# EAGLE design CBM_TAPE_PI (EAGLE 9.6.2)
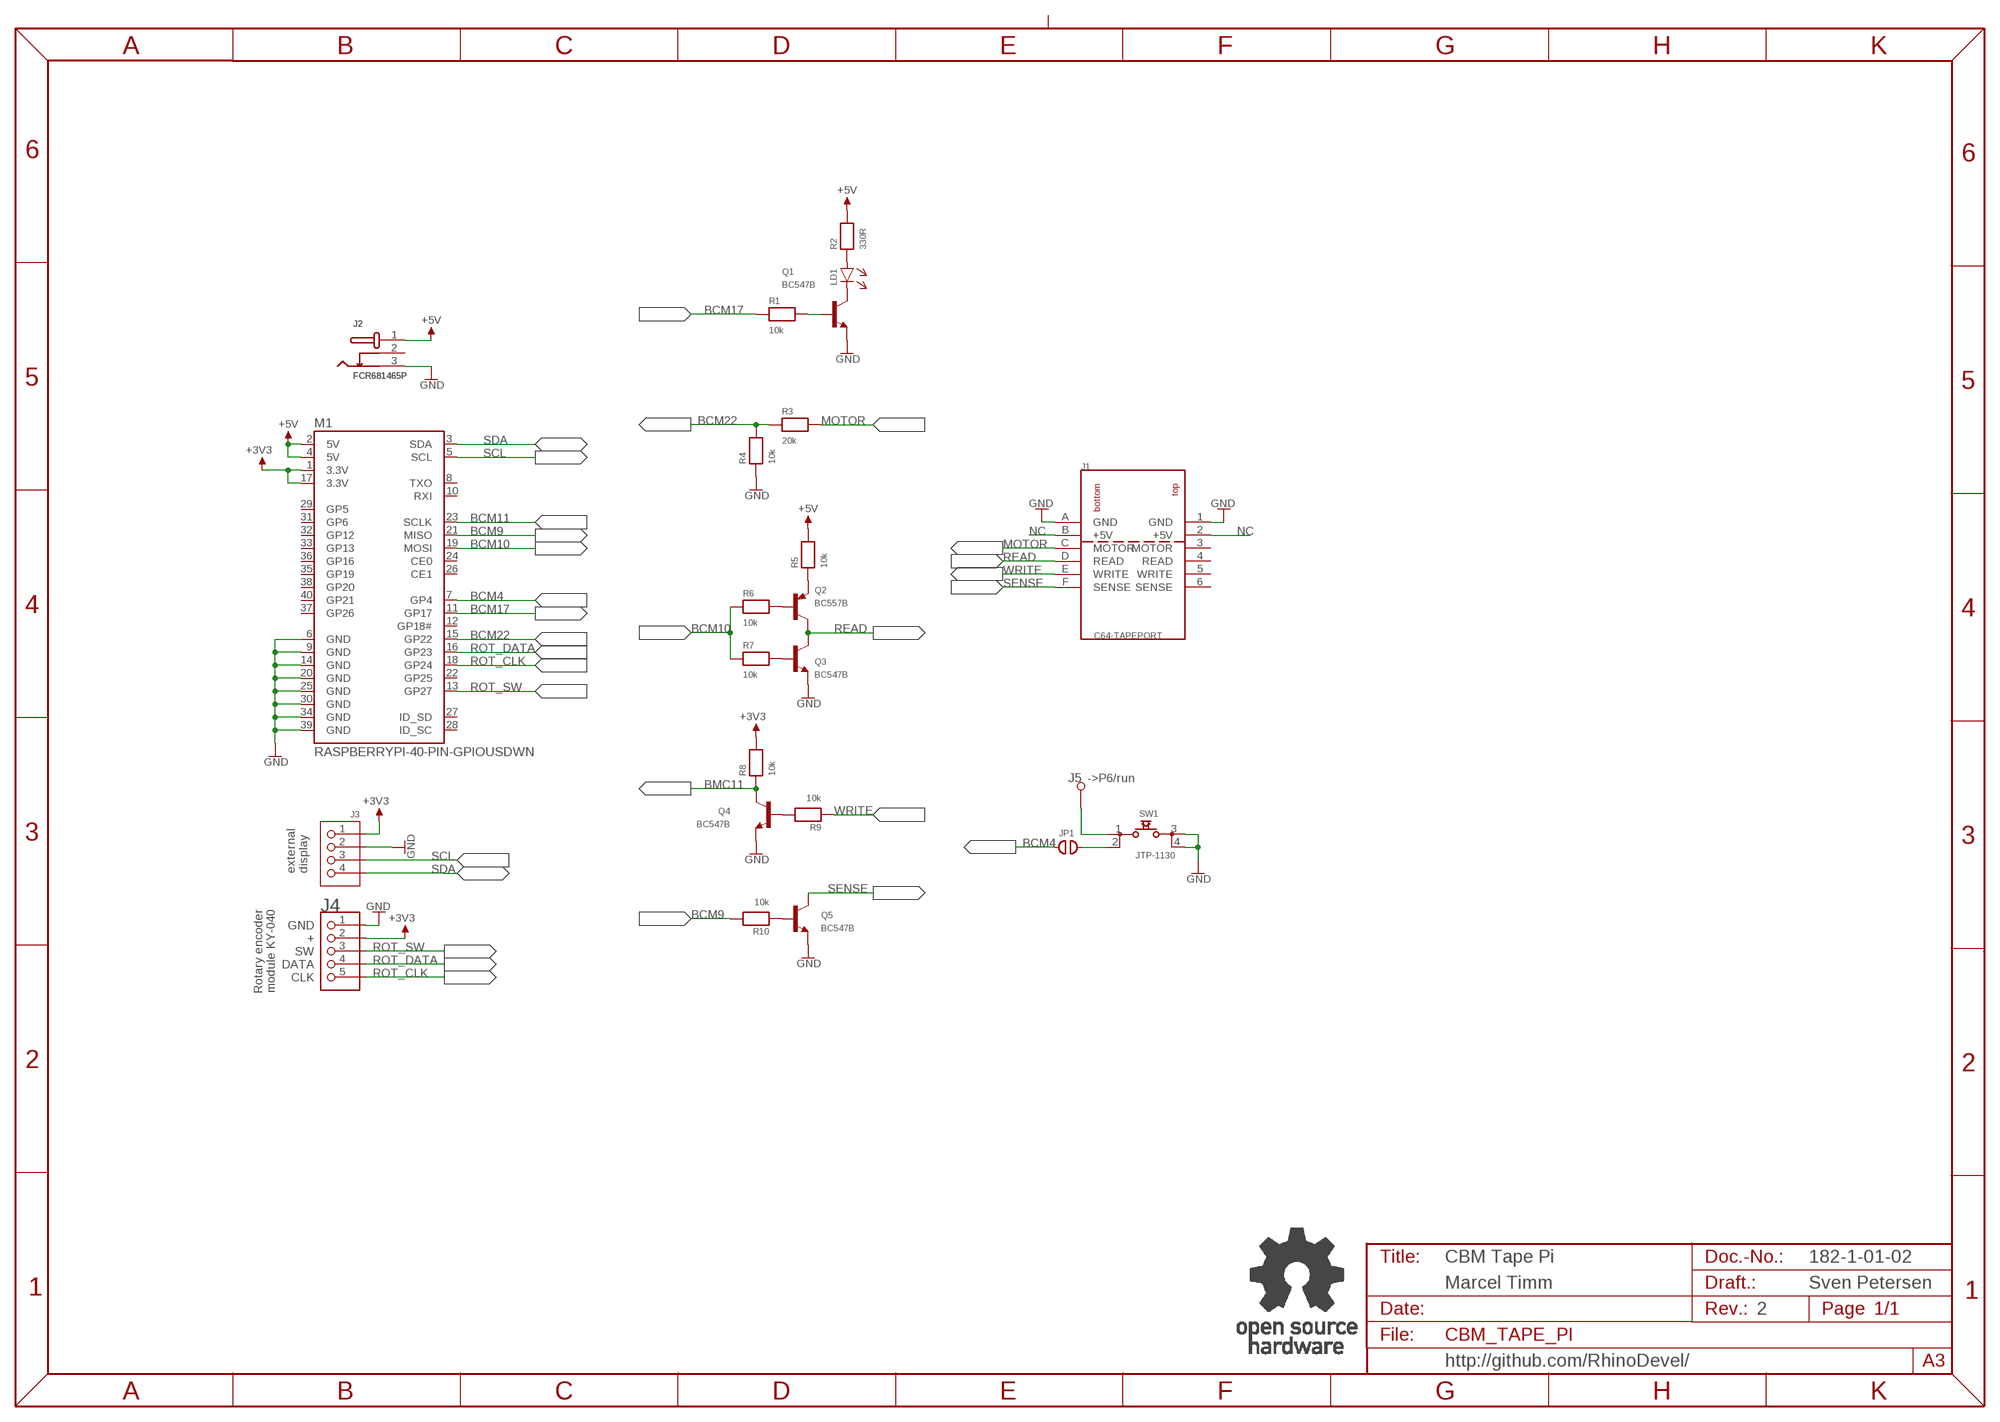
[diagram p0: schematic, sheet 1]

## Parts
J1  C64-TAPEPORT  [TAPEPORT]
J2  FCR681465P  [FCR681465P]
J3  6410-4P  [6410-4P]
J4  6410-5P  [6410-5P]
J5  L1,2_R  [1,2MM_R]
JP1  OPEN  [CP_OP]
LD1  3MM  [3MM]
M1  RASPBERRYPI-40-PIN-GPIOUSDWN  [PI_HAT_40P_UPSIDEDOWN]
Q1  BC547B  [TO92]
Q2  BC557B  [TO92-EBC]
Q3  BC547B  [TO92]
Q4  BC547B  [TO92]
Q5  BC547B  [TO92]
R1  10k  RES04  [R-10]
R2  330R  RES04  [R-10]
R3  20k  RES04  [R-10]
R4  10k  RES04  [R-10]
R5  10k  RES04  [R-10]
R6  10k  RES04  [R-10]
R7  10k  RES04  [R-10]
R8  10k  RES04  [R-10]
R9  10k  RES04  [R-10]
R10  10k  RES04  [R-10]
SW1  JTP-1130  [JTP-1130]
U$2  OPEN_SOURCE_HW  [OPENHW]

## Nets
+3V3: J3.1 J4.2 M1.1(3.3V) M1.17(3.3V) R8.2
+5V: J2.1 M1.2(5V) M1.4(5V) R2.2 R5.2
BCM4: JP1.1 M1.7(GP4)
BCM9: M1.21(MISO) R10.2
BCM10: M1.19(MOSI) R6.1 R7.1
BCM11: M1.23(SCLK)
BCM17: M1.11(GP17) R1.1
BCM22: M1.15(GP22) R3.1 R4.2
BMC11: Q4.3(C) R8.1
GND: J1.1(GND) J1.A(GND) J2.3 J3.2 J4.1 M1.6(GND) M1.9(GND) M1.14(GND) M1.20(GND) M1.25(GND) M1.30(GND) M1.34(GND) M1.39(GND) Q1.1(E) Q3.1(E) Q4.1(E) Q5.1(E) R4.1 SW1.3 SW1.4
MOTOR: J1.C(MOTOR) R3.2
N$1: Q1.2(B) R1.2
N$2: LD1.C(K) Q1.3(C)
N$3: LD1.A R2.1
N$4: Q2.E R5.1
N$5: Q2.B R6.2
N$6: Q3.2(B) R7.2
N$7: Q4.2(B) R9.2
N$8: Q5.2(B) R10.1
N$9: J5.1 SW1.1
N$10: JP1.2 SW1.2
NC: J1.2(+5V) J1.B(+5V)
READ: J1.D(READ) Q2.C Q3.3(C)
ROT_CLK: J4.5 M1.18(GP24)
ROT_DATA: J4.4 M1.16(GP23)
ROT_SW: J4.3 M1.13(GP27)
SCL: J3.3 M1.5(SCL)
SDA: J3.4 M1.3(SDA)
SENSE: J1.F(SENSE) Q5.3(C)
WRITE: J1.E(WRITE) R9.1
Unconnected: J1.3(MOTOR) J1.4(READ) J1.5(WRITE) J1.6(SENSE) J2.2 M1.8(TXO) M1.10(RXI) M1.12(GP18#) M1.22(GP25) M1.24(CE0) M1.26(CE1) M1.27(ID_SD) M1.28(ID_SC) M1.29(GP5) M1.31(GP6) M1.32(GP12) M1.33(GP13) M1.35(GP19) M1.36(GP16) M1.37(GP26) M1.38(GP20) M1.40(GP21)

## Notes on the sheet
- ->P6/run
- external
  display
- GND
- +
- Rotary encoder
  module KY-040
- SW
- DATA
- CLK
- CBM Tape Pi | 182-1-01-02
- Marcel Timm | Sven Petersen
- 2
- http://github.com/RhinoDevel/

## Library data of the parts
J1 = Commodore:C64-TAPEPORT
J2 = Cliff:FCR681465P
J3 = MOLEX:6410-4P: 6410/22-27-2041
J4 = MOLEX:6410-5P: 6410/22-27-2051
J5 = Pads:L1,2_R
JP1 = Cutpad:OPEN: open Cutpad
LD1 = LED:3MM
M1 = Raspberry_Pi:RASPBERRYPI-40-PIN-GPIO: 40 pin GPIO header with the footprint of a HAT
Q1 Q3-Q5 = Transistoren:BC547*: NPN Transistor
Q2 = Transistoren:BC557*: PNP Transistror
R1-R10 = DISCRETE:RES04
SW1 = Namae_Electronics:JTP-1130
U$2 = Logo:OPEN_SOURCE_HW

## Board
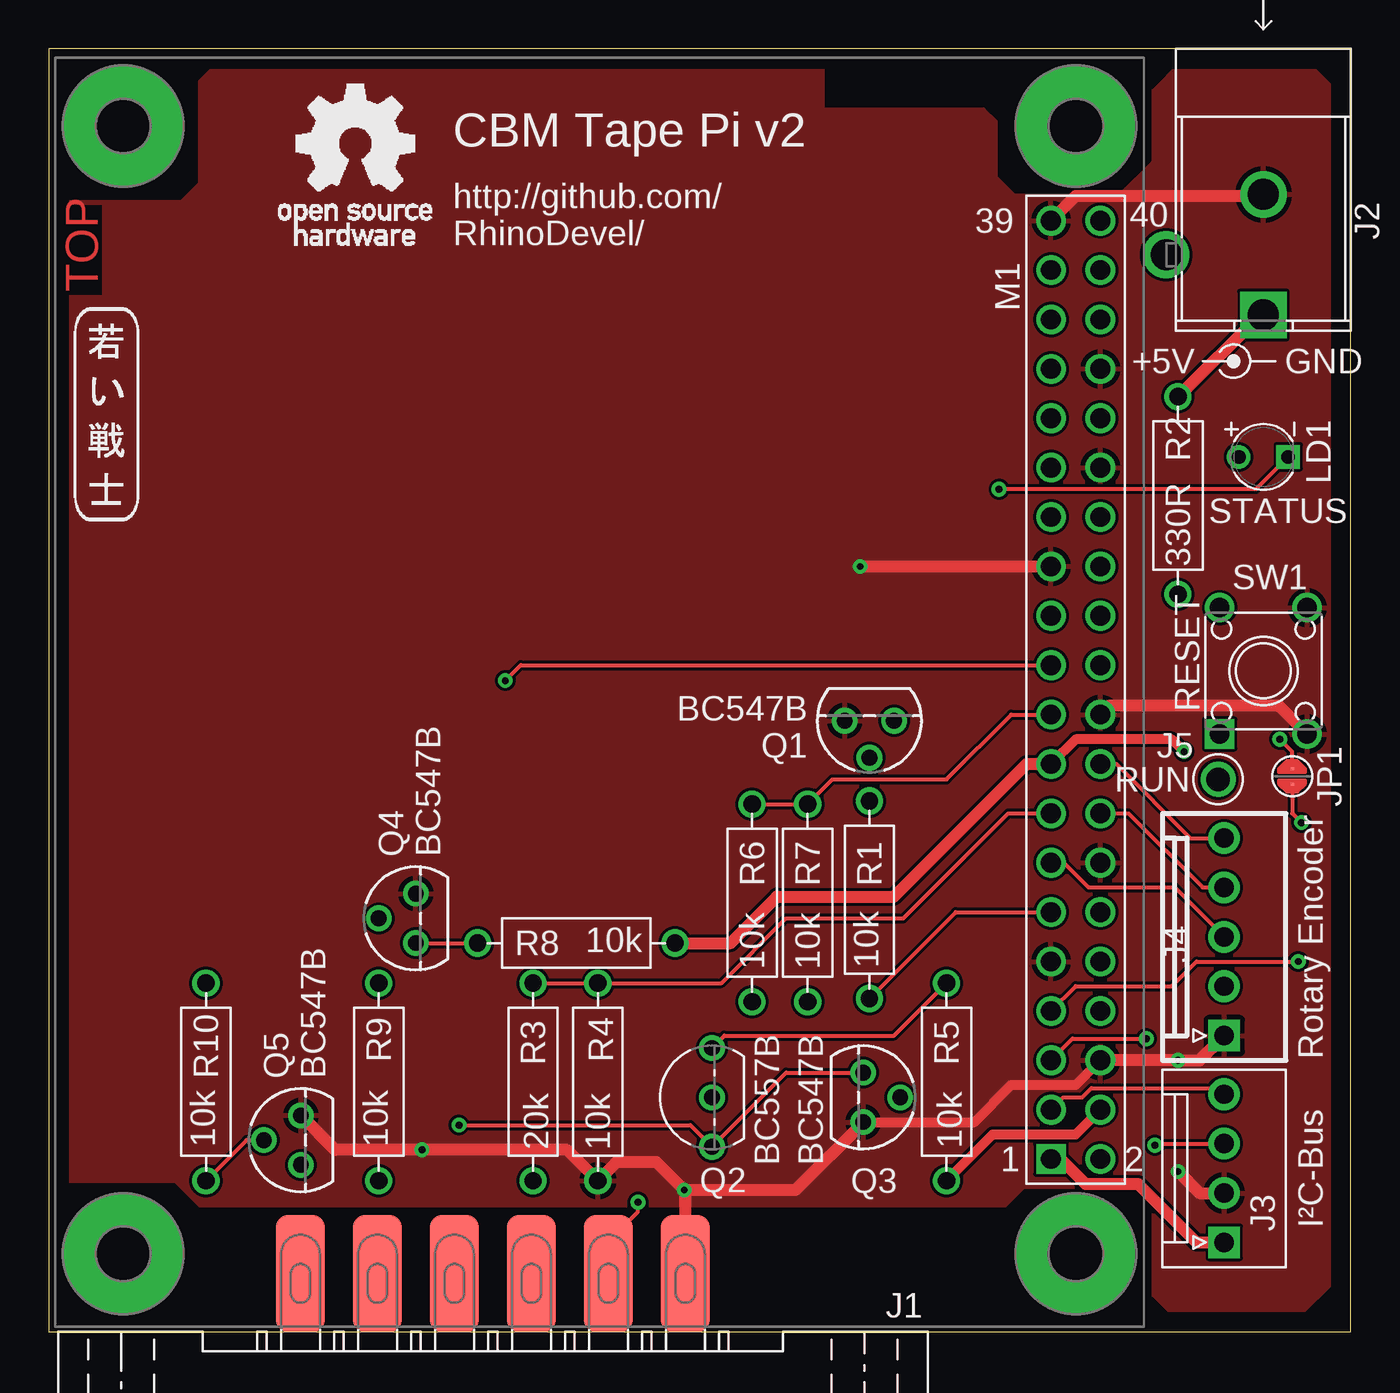
[diagram p1: board, top side]
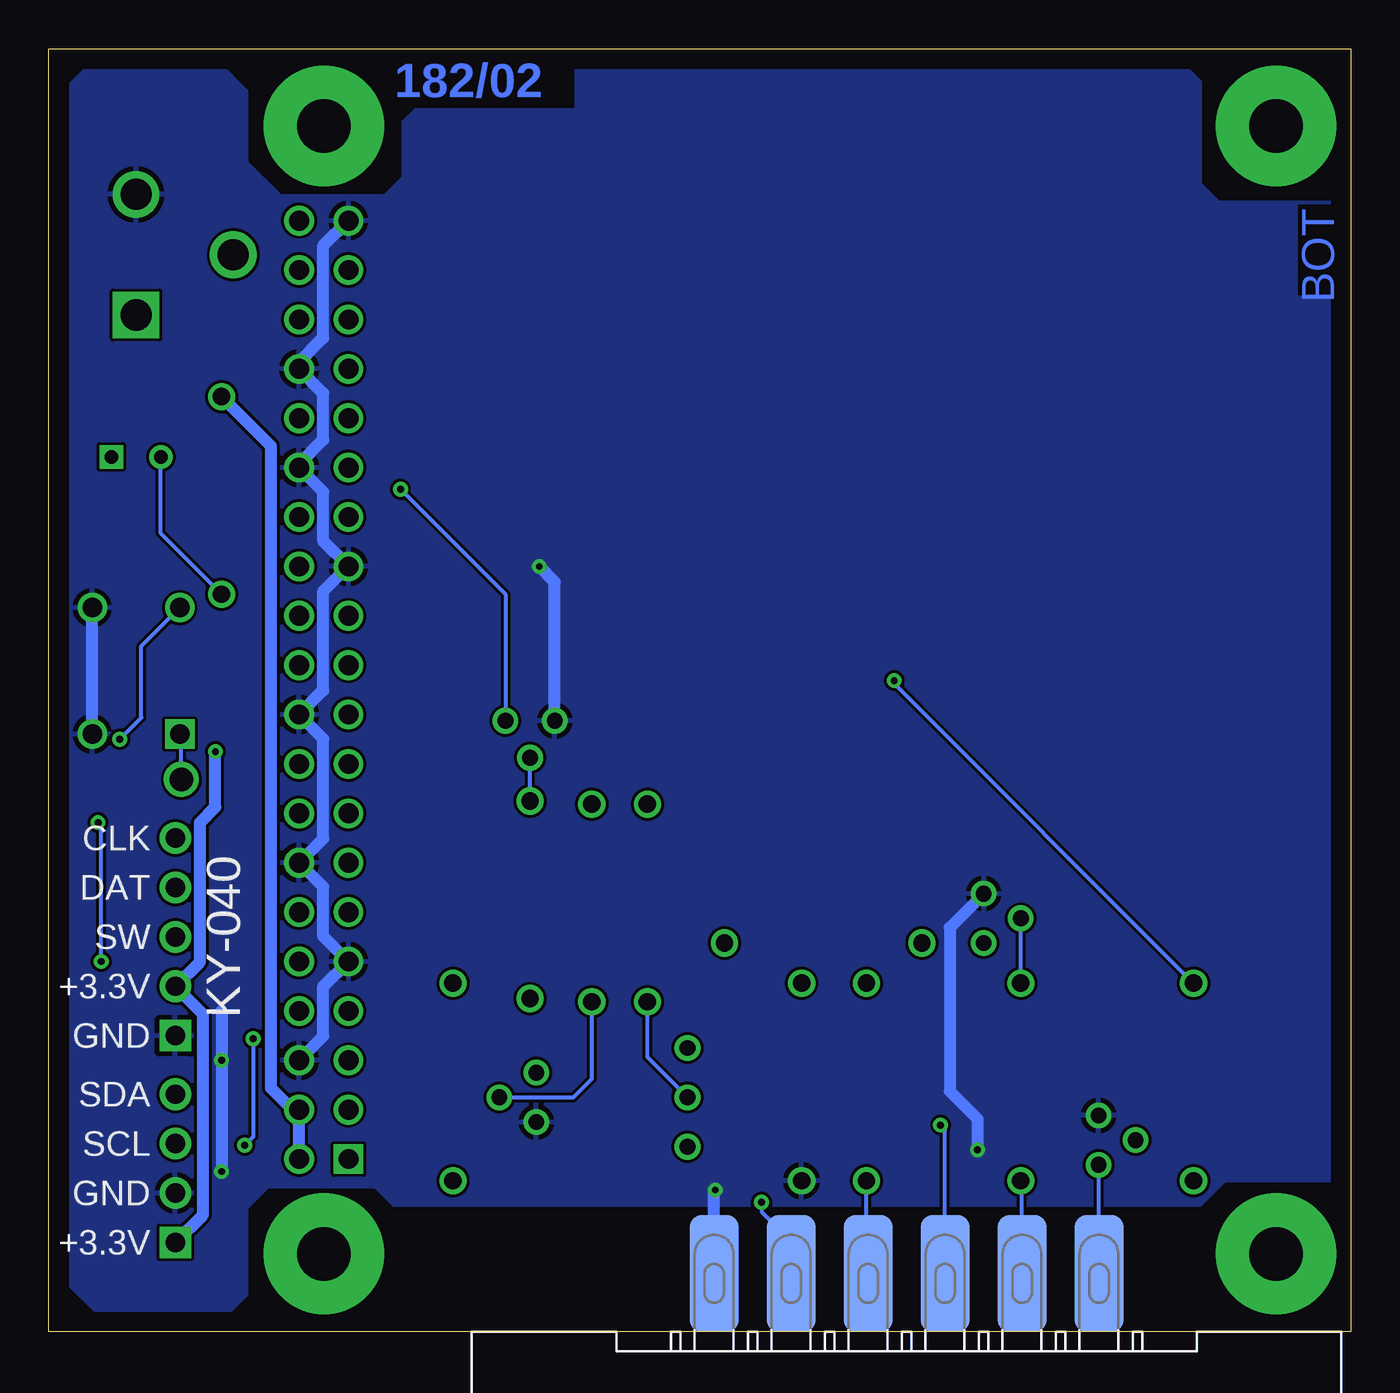
[diagram p2: board, bottom side, seen from below]

Size 67 x 66 mm. Coordinates in mm from the lower left corner, seen from the top.
Outline: 0,0 67,0 67,66 0,66 0,0
Copper layers (1*16): Top 0.035mm / dielectric 1.5mm / Bottom 0.035mm
Design rules "default *": minimum track width 6mil, minimum drill 0.35mm, track to track 6mil, track to pad 6mil, pad to pad 6mil, via to via 6mil, smd to smd 6mil, copper to edge 40mil, drill to drill 6mil, minimum pad ring 10mil, minimum via ring 8mil, stop-mask expansion 4mil, vias tented up to drill 25mil, thermal gap 10mil

### Footprints (pad centres in the part's own frame; a part is rotated, then mirrored left to right if it is on the bottom)
TAPEPORT = smd 2.5 x 6: 1 -9.9,-3; 2 -5.94,-3; 3 -1.98,-3; 4 1.98,-3; 5 5.94,-3; 6 9.9,-3 | smd 2.5 x 6 bottom: A -9.9,-3; B -5.94,-3; C -1.98,-3; D 1.98,-3; E 5.94,-3; F 9.9,-3
FCR681465P = drill 1.6 square: 1 0,13.7 | drill 1.6: 2 5,10.6; 3 0,7.5
6410-4P = drill 1 pad 1.626 square: 1 -3.81,0 | drill 1 pad 1.626: 2 -1.27,0; 3 1.27,0; 4 3.81,0
6410-5P = drill 1 pad 1.626 square: 1 -5.08,0 | drill 1 pad 1.626: 2 -2.54,0; 3 0,0; 4 2.54,0; 5 5.08,0
1,2MM_R = drill 1.2: 1 0,0
CP_OP = smd 0.152 x 0.152: 1 -0.4,0; 2 0.4,0
3MM = drill 0.7: A -1.27,0 | drill 0.7 square: C 1.27,0
PI_HAT_40P_UPSIDEDOWN = drill 1.016 square: 1 1.27,24.13 | drill 1.016: 2 -1.27,24.13; 3 1.27,21.59; 4 -1.27,21.59; 5 1.27,19.05; 6 -1.27,19.05; 7 1.27,16.51; 8 -1.27,16.51; 9 1.27,13.97; 10 -1.27,13.97; 11 1.27,11.43; 12 -1.27,11.43; 13 1.27,8.89; 14 -1.27,8.89; 15 1.27,6.35; 16 -1.27,6.35; 17 1.27,3.81; 18 -1.27,3.81; 19 1.27,1.27; 20 -1.27,1.27; 21 1.27,-1.27; 22 -1.27,-1.27; 23 1.27,-3.81; 24 -1.27,-3.81; 25 1.27,-6.35; 26 -1.27,-6.35; 27 1.27,-8.89; 28 -1.27,-8.89; 29 1.27,-11.43; 30 -1.27,-11.43; 31 1.27,-13.97; 32 -1.27,-13.97; 33 1.27,-16.51; 34 -1.27,-16.51; 35 1.27,-19.05; 36 -1.27,-19.05; 37 1.27,-21.59; 38 -1.27,-21.59; 39 1.27,-24.13; 40 -1.27,-24.13 | drill 2.75 pad 6.2: BHR1 0,-29; BHR2 0,29; BHR3 49,29; BHR4 49,-29
TO92 = drill 0.813: 1 1.27,0; 2 0,1.905; 3 -1.27,0
TO92-EBC = drill 0.813: B 0,-1.27; C -2.54,-1.27; E 2.54,-1.27
R-10 = drill 0.889 pad 1.397: 1 -5.08,0; 2 5.08,0
JTP-1130 = drill 1 square: 1 3.25,-2.25 | drill 1: 2 -3.25,-2.25; 3 3.25,2.25; 4 -3.25,2.25

### Placement (x,y rotation side)
J1  22.86,0 180 top
J2  62.5,66 180 top
J3  60.48,8.41 90 top
J4  60.48,20.32 90 top
J5  60.17,28.42 0 top
JP1  63.98,28.57 90 top
LD1  62.5,45 0 top
M1  52.84,33.02 180 top
Q1  42.23,31.43 180 top
Q2  32.86,12.06 90 top
Q3  41.91,12.06 270 top
Q4  18.89,21.27 90 top
Q5  12.98,9.86 90 top
R1  42.23,22.23 90 top
R2  58.1,43.02 90 top
R3  24.92,12.86 270 top
R4  28.26,12.86 90 top
R5  46.2,12.86 270 top
R6  36.2,22.07 270 top
R7  39.05,22.07 270 top
R8  27.15,20 0 top
R9  16.99,12.86 90 top
R10  8.1,12.86 90 top
SW1  62.5,34 270 top
U$2  11.84,55.9 0 top
U$53  [2LAYER]  2.54,53.5 90 top
U$54  [SVEN_TAG]  3.02,47.31 0 top
U$55  [PCB-TITLE/]  0,76.2 0 top  (outside the outline)

### Tracks (layer width: path | path; a pad name or v marks a point on that pad's centre or on a via)
+3V3  (via drill 0.35)
  Top 0.508: v58.42,29.84 57.78,30.48 52.84,30.48 M1.17
  Top 0.61: R8.2 35.08,20 37.47,22.38 43.5,22.38 50.32,29.21 M1.17 | M1.1 52.07,8.89 53.34,7.62 56.04,7.62 59.05,4.6 J3.1
  Bottom 0.61: J3.1 59.05,6.03 59.05,16.35 J4.2 59.21,19.05 59.21,26.19 58.42,26.99 v58.42,29.84
+5V
  Top 0.508: R5.2 48.58,10.16 52.84,10.16 M1.4
  Top 0.61: R2.2 62.3,52.3 J2.1
  Bottom 0.61: M1.2 M1.4 54.45,11.43 55.56,12.54 55.56,45.56 R2.2
BCM4  (via drill 0.35)
  Top 0.203: M1.7 52.84,17.78 57.78,17.78 59.05,19.05 v64.29,19.05 | JP1.1 63.98,26.67 v64.45,26.19
  Bottom 0.203: v64.29,19.05 64.29,26.04 v64.45,26.19
BCM9  (via drill 0.35)
  Top 0.203: v23.5,33.5 24.29,34.29 M1.21
  Bottom 0.203: R10.2 23.5,33.34 v23.5,33.5
BCM10
  Top 0.203: R6.1 R7.1 40.32,28.42 46.2,28.42 49.53,31.75 M1.19
BCM17
  Top 0.203: R1.1 46.67,21.59 M1.11
BCM22
  Top 0.203: R3.1 R4.2 34.61,17.94 37.94,21.27 43.97,21.27 49.37,26.67 M1.15
BMC11
  Top 0.203: Q4.3 R8.1
GND  (via drill 0.35)
  Top 0.508: Q3.1 47.62,10.79 49.53,12.7 52.84,12.7 M1.6
  Top 0.61: J1.1 32.76,7.25 v32.7,7.3 | v32.7,7.3 38.42,7.3 Q3.1 | v32.7,7.3 31.27,8.73 29.21,8.73 R4.1 26.67,9.37 v19.21,9.37 14.75,9.37 Q5.1 | M1.6 v58.1,13.97 59.21,13.97 J4.1 | M1.20 54.59,32.23 63.27,32.23 SW1.3 | M1.39 52.84,58.42 62.42,58.42 J2.3 | v58.1,8.26 59.21,7.14 J3.2 | v41.75,39.37 M1.25
  Bottom 0.61: J1.1 32.76,7.25 v32.7,7.3 | Q4.1 20.64,20.8 20.64,12.38 19.21,10.95 v19.21,9.37 | v58.1,8.26 v58.1,13.97 58.1,16.51 | M1.6 52.86,15.22 52.86,17.78 51.59,19.05 M1.9 52.86,20.34 52.86,22.88 M1.14 52.86,25.38 52.86,30.5 M1.20 52.86,33 52.86,38.1 51.59,39.37 M1.25 52.86,40.66 52.86,43.2 M1.30 54.11,44.63 52.86,45.88 52.86,48.28 M1.34 54.11,49.87 52.86,51.12 52.86,55.88 51.59,57.15 M1.39 | Q1.1 40.96,38.58 v41.75,39.37 | SW1.3 SW1.4
  pour Bottom: 0.79,7.78 6.51,7.78 7.78,6.51 49.21,6.51 50.16,7.46 55.72,7.46 56.83,6.35 56.83,1.91 57.78,0.95 64.45,0.95 66.04,2.54 66.04,63.98 64.77,65.25 58.26,65.25 56.83,63.82 56.83,60.17 55.09,58.42 49.69,58.42 48.74,59.37 48.74,62.23 48.1,62.87 39.85,62.87 39.85,65.25 8.73,65.25 7.78,64.29 7.78,59.05 6.83,58.1 0.79,58.1
  pour Top: 0.79,7.78 6.51,7.78 7.78,6.51 49.21,6.51 50.16,7.46 55.72,7.46 56.83,6.35 56.83,1.91 57.78,0.95 64.45,0.95 66.04,2.54 66.04,63.98 64.77,65.25 58.26,65.25 56.83,63.82 56.83,60.17 55.09,58.42 49.69,58.42 48.74,59.37 48.74,62.23 48.1,62.87 39.85,62.87 39.85,65.25 8.73,65.25 7.78,64.29 7.78,59.05 6.83,58.1 0.79,58.1
MOTOR
  Bottom 0.203: J1.C 24.92,3.08 R3.2
N$1
  Bottom 0.203: R1.2 Q1.2
N$2  (via drill 0.35)
  Top 0.203: LD1.C 62.11,43.34 v48.9,43.34
  Bottom 0.203: v48.9,43.34 43.5,37.94 Q1.3
N$3
  Bottom 0.203: R2.1 61.23,41.07 LD1.A
N$4
  Top 0.203: Q2.E 34.77,15.24 43.5,15.24 R5.1
N$5
  Bottom 0.203: Q2.B 36.2,14.13 R6.2
N$6
  Bottom 0.203: Q3.2 40.01,12.06 39.05,13.02 R7.2
N$7
  Bottom 0.203: R9.2 Q4.2
N$8
  Top 0.203: R10.1 10.18,9.86 Q5.2
N$9
  Bottom 0.203: J5.1 60.17,30.67 SW1.1
N$10  (via drill 0.35)
  Top 0.203: JP1.2 63.98,29.84 v63.34,30.48
  Bottom 0.203: v63.34,30.48 62.23,31.59 62.23,35.27 SW1.2
NC  (via drill 0.35)
  Top 0.203: J1.2 28.8,4.67 30.32,6.19 v30.32,6.67
  Bottom 0.203: v30.32,6.67 30.32,6.19 29.05,4.92 28.89,4.92 28.8,4.83 J1.2
READ  (via drill 0.35)
  Top 0.203: v21.11,10.64 33.02,10.64 Q2.C 37.94,13.34 Q3.3
  Bottom 0.203: J1.D 20.88,10.4 v21.11,10.64
ROT_CLK
  Top 0.203: M1.18 54.93,29.21 58.74,25.4 J4.5
ROT_DATA
  Top 0.203: M1.16 55.56,26.67 59.37,22.86 J4.4
ROT_SW
  Top 0.203: M1.13 52.23,24.13 53.5,22.86 57.94,22.86 J4.3
SCL  (via drill 0.35)
  Top 0.203: M1.5 52.68,15.08 v56.47,15.08 | v56.47,15.08 56.52,15.08 v56.47,15.08 | v56.91,9.6 56.99,9.68 J3.3
  Bottom 0.203: v56.47,15.08 56.47,10.04 v56.91,9.6
SDA
  Top 0.203: M1.3 52.2,12.06 53.18,12.06 53.66,12.54 60.17,12.54 J3.4
SENSE
  Bottom 0.203: J1.F 12.96,8.57 Q5.3
WRITE
  Bottom 0.203: J1.E 16.92,7.71 R9.1

### Text on the board
Bottom: 182/02
tPlace: CBM Tape Pi v2 | http://github.com/ / RhinoDevel/ | +5V | GND | STATUS | RESET
bPlace: CLK | DAT | KY-040 | SW | +3.3V | GND | SDA | SCL | GND | +3.3V
tNames: RUN | Rotary Encoder | I²C-Bus
Document: Marcel Timm | 182-2-01-02 | 2021 | 35µm | 2